# Altium schematic sheet xover.SchDoc
size A
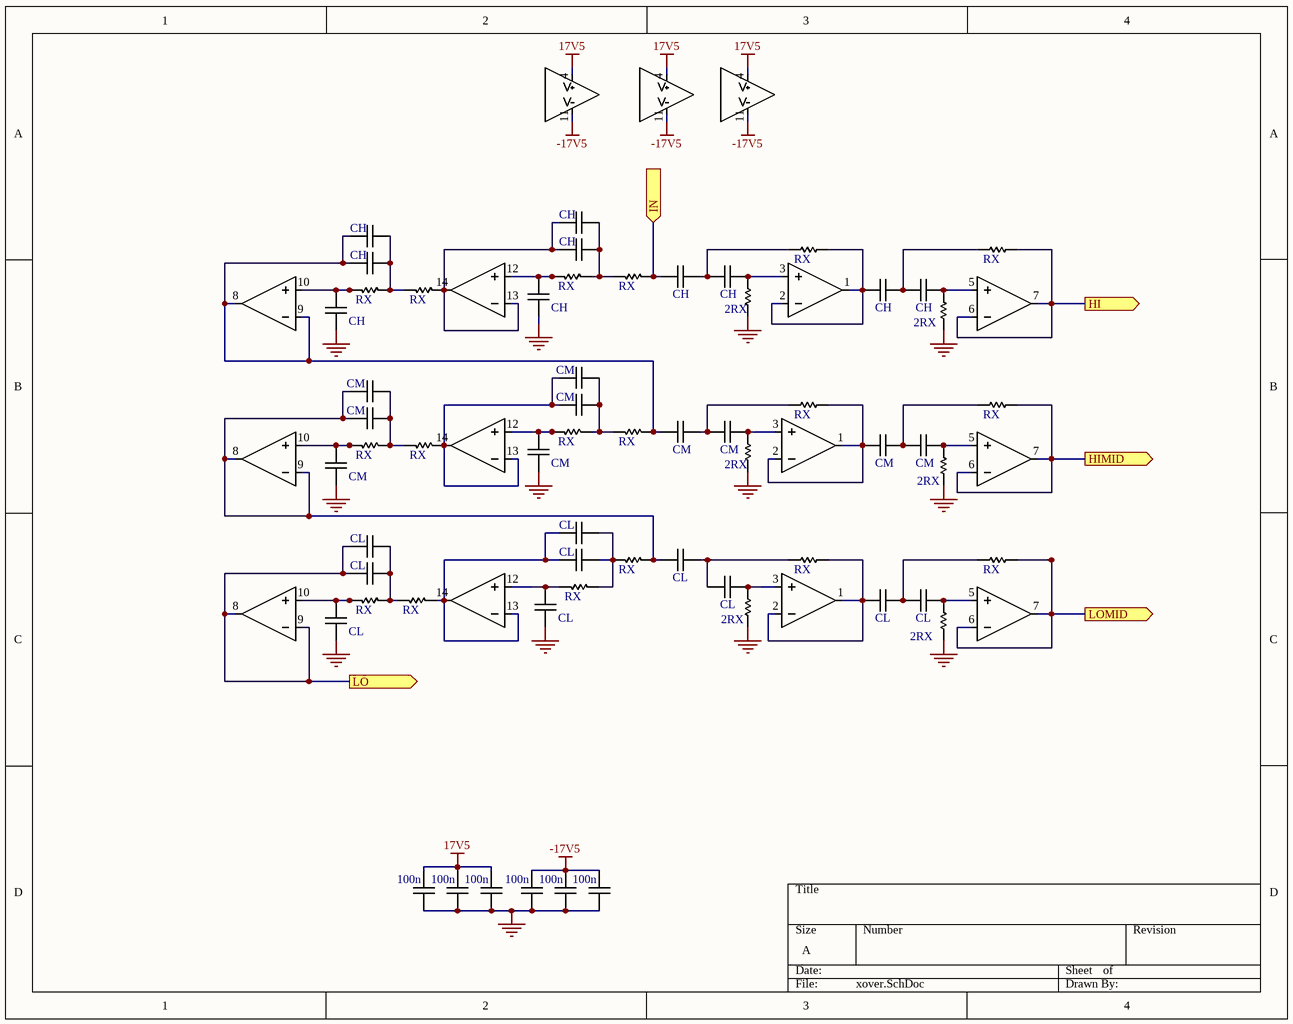
[diagram p0: xover.SchDoc]

## Parts
C136  CH  [0805]
C139  CH  [0805]
C142  CH  [0805]
C143  CH  [0805]
C145  CH  [0805]
C148  CH  [0805]
C149  CH  [0805]
C150  CH  [0805]
C152  CH  [0805]
C154  CH  [0805]
C155  CM  [0805]
C158  CM  [0805]
C162  CM  [0805]
C163  CM  [0805]
C166  CM  [0805]
C170  CM  [0805]
C171  CM  [0805]
C172  CM  [0805]
C174  CM  [0805]
C176  CM  [0805]
C180  CL  [0805]
C182  CL  [0805]
C185  CL  [0805]
C186  CL  [0805]
C188  CL  [0805]
C192  CL  [0805]
C193  CL  [0805]
C194  CL  [0805]
C198  CL  [0805]
C200  CL  [0805]
C204  100n  [0805]
C206  100n  [0805]
C211  100n  [0805]
C213  100n  [0805]
C217  100n  [0805]
C218  100n  [0805]
R154  RX  [0805]
R156  RX  [0805]
R158  RX  [0805]
R159  RX  [0805]
R162  RX  [0805]
R163  RX  [0805]
R165  2RX  [0805]
R167  2RX  [0805]
R169  RX  [0805]
R170  RX  [0805]
R172  RX  [0805]
R176  RX  [0805]
R180  RX  [0805]
R181  RX  [0805]
R183  2RX  [0805]
R186  2RX  [0805]
R189  RX  [0805]
R191  RX  [0805]
R194  RX  [0805]
R195  RX  [0805]
R198  RX  [0805]
R199  RX  [0805]
R203  2RX  [0805]
R205  2RX  [0805]
U27  OPA16X4  [SOIC127P600X175-14M]  (value not drawn)  (parts A,B,C,D,E of 5)
U28  OPA16X4  [SOIC127P600X175-14M]  (value not drawn)  (parts A,B,C,D,E of 5)
U29  OPA16X4  [SOIC127P600X175-14M]  (value not drawn)  (parts A,B,C,D,E of 5)

## Ports
HI (out), HIMID (out), IN (in), LO (out), LOMID (out)

## Nets
17V5: C211.1 C213.1 C218.1 U27.4(V+) U28.4(V+) U29.4(V+)
-17V5: C204.1 C206.1 C217.1 U27.11(V-) U28.11(V-) U29.11(V-)
GND: C152.1 C154.1 C174.1 C176.1 C198.1 C200.1 C204.2 C206.2 C211.2 C213.2 C217.2 C218.2 R165.2 R167.1 R183.2 R186.1 R203.2 R205.1
HI: R163.1 U27.6(IN_B-) U27.7(OUT_B) ; port HI
HIMID: R181.1 U28.6(IN_B-) U28.7(OUT_B) ; port HIMID
IN: C142.1 R154.1 ; port IN
LO: C182.1 C188.1 U29.8(OUT_C) U29.9(IN_C-) ; port LO
LOMID: R199.1 U29.6(IN_B-) U29.7(OUT_B) ; port LOMID
NetC136_1: C136.1 C143.1 R158.1 U27.13(IN_D-) U27.14(OUT_D)
NetC136_2: C136.2 C143.2 R154.2 R156.1
NetC139_1: C139.1 C145.1 C162.1 R169.1 U27.8(OUT_C) U27.9(IN_C-)
NetC139_2: C139.2 C145.2 R158.2 R159.1
NetC142_2: C142.2 C148.1 R162.2
NetC148_2: C148.2 R167.2 U27.3(+IN_A)
NetC149_1: C149.1 R162.1 U27.1(OUT_A) U27.2(-IN_A)
NetC149_2: C149.2 C150.1 R163.2
NetC150_2: C150.2 R165.1 U27.5(IN_B+)
NetC152_2: C152.2 R156.2 U27.12(IN_D+)
NetC154_2: C154.2 R159.2 U27.10(IN_C+)
NetC155_1: C155.1 C163.1 R170.1 U28.13(IN_D-) U28.14(OUT_D)
NetC155_2: C155.2 C163.2 R169.2 R172.1
NetC158_1: C158.1 C166.1 C185.2 R189.1 U28.8(OUT_C) U28.9(IN_C-)
NetC158_2: C158.2 C166.2 R170.2 R176.1
NetC162_2: C162.2 C170.1 R180.2
NetC170_2: C170.2 R186.2 U28.3(+IN_A)
NetC171_1: C171.1 R180.1 U28.1(OUT_A) U28.2(-IN_A)
NetC171_2: C171.2 C172.1 R181.2
NetC172_2: C172.2 R183.1 U28.5(IN_B+)
NetC174_2: C174.2 R172.2 U28.12(IN_D+)
NetC176_2: C176.2 R176.2 U28.10(IN_C+)
NetC180_1: C180.1 C186.1 R194.1 U29.13(IN_D-) U29.14(OUT_D)
NetC180_2: C180.2 C186.2 R189.2 R191.1
NetC182_2: C182.2 C188.2 R194.2 R195.1
NetC185_1: C185.1 C192.1 R198.2
NetC192_2: C192.2 R205.2 U29.3(+IN_A)
NetC193_1: C193.1 R198.1 U29.1(OUT_A) U29.2(-IN_A)
NetC193_2: C193.2 C194.1 R199.2
NetC194_2: C194.2 R203.1 U29.5(IN_B+)
NetC198_2: C198.2 R191.2 U29.12(IN_D+)
NetC200_2: C200.2 R195.2 U29.10(IN_C+)

## Library data of the parts
C136 C139 C142 C143 C145 C148-C150 C152 C154 = CAP: PartNumber: NMC0805NPO562J50TRPLPF; Supplier 1: Arrow; Supplier Part Number 1: NMC0805NPO562J50TRPLPF
C155 C158 C162 C163 C166 C170-C172 C174 C176 = CAP: PartNumber: C0805C223J5JACTU; Supplier 1: Arrow; Supplier Part Number 1: C0805C223J5JACTU
C180 C182 C185 C186 C188 C192-C194 C198 C200 = CAP: PartNumber: NMC0805X7R823J50TRPF; Supplier 1: Arrow; Supplier Part Number 1: NMC0805X7R823J50TRPF
C204 C206 C211 C213 C217 C218 = CAP: PartNumber: C0805C104K1RAC7800; Supplier 1: Arrow; Supplier Part Number 1: C0805C104K1RAC7800
R154 R156 R158 R159 R162 R163 R169 R170 R172 R176 R180 R181 R189 R191 R194 R195 R198 R199 = RES: PartNumber: ERJ-6ENF4871V; Supplier 1: Arrow; Supplier Part Number 1: ERJ-6ENF4871V
  R191: Parameter 1: *
R165 R167 R183 R186 R203 R205 = RES: PartNumber: ERJ-6ENF9761V; Supplier 1: Arrow; Supplier Part Number 1: ERJ-6ENF9761V
U27-U29 = OPA16X4: PartNumber: OPA1664AIDR; Supplier 1: Arrow; Supplier Part Number 1: OPA1664AIDR